# Altium schematic sheet UCC27511_MSFTDRIVER.SchDoc
size B; Organization: Altium Limited; Address1: L3, 12a Rodborough Rd; Address2: Frenchs Forest; Address3: NSW; Address4: Australia 2086; SheetNumber: 1; SheetTotal: 1
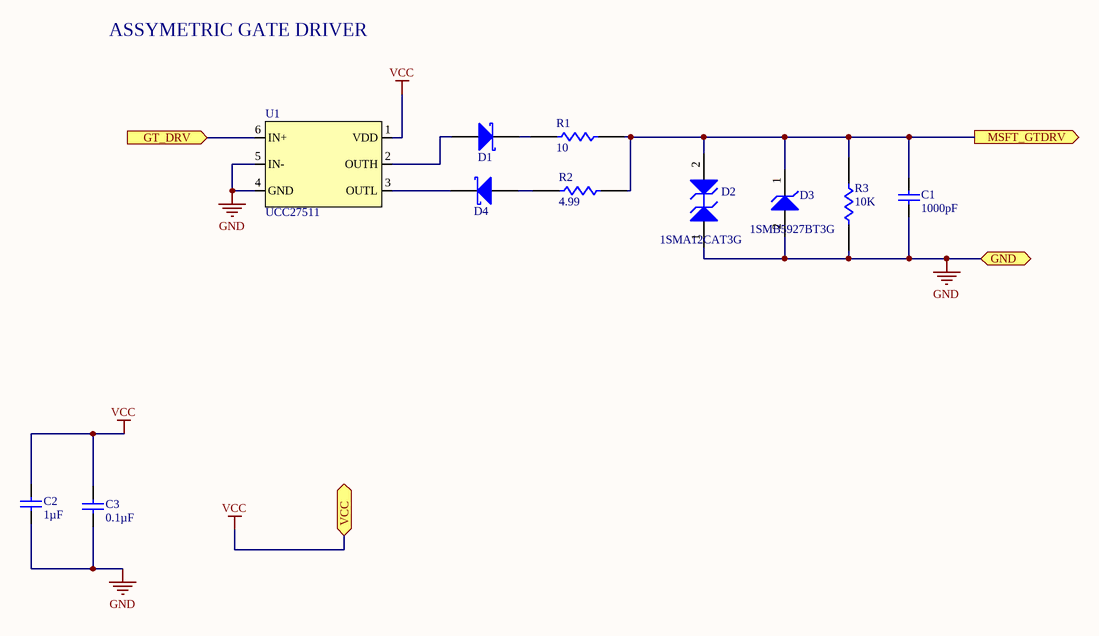
[diagram p0: UCC27511_MSFTDRIVER.SchDoc]

## Parts
C1  Capacitance: 1000pF  [CAP0805_NEW]  (hidden comment: C0805C102J5GACTU)
C2  Capacitance: 1µF  [CAP0805_NEW]  (hidden comment: CC0805JKX7R9BB105)
C3  Capacitance: 0.1µF  [CAP0805_NEW]  (hidden comment: C0805C104J5RACAUTO)
D1  DB2W40300L  [Mini2-F3-B]  (value not drawn)
D2  1SMA12CAT3G  [ONSC-SMA-2-403D-02_F_V]
D3  1SMB5927BT3G  [ONSC-SMB-2-403A-03_H_V]
D4  DB2W40300L  [Mini2-F3-B]  (value not drawn)
R1  Resistance: 10  [RES0805]  (hidden comment: CRCW0805R10)
R2  Resistance: 4.99  [RES0805]  (hidden comment: CRCW0805R4.99)
R3  Resistance: 10K  [RES0805_New]  (hidden comment: TNPW080510K0FEEA)
U1  IC name: UCC27511  [SOP6]  (hidden comment: UCC27511DBV)

## Ports
GND, GT_DRV (in), MSFT_GTDRV (out), VCC

## Nets
GND: C1.1 C2.1 C3.1 D2.1(A1) D3.2(A) R3.2 U1.4(GND) U1.5(IN-) ; port GND
VCC: C2.2 C3.2 U1.1(VDD) ; port VCC
GT_DRV: U1.6(IN+) ; port GT_DRV
MSFT_GTDRV: C1.2 D2.2(A2) D3.1(K) R1.1 R2.1 R3.1 ; port MSFT_GTDRV
NetD1_1: D1.1(K) R1.2
NetD1_3: D1.3(A) U1.2(OUTH)
NetD4_1: D4.1(K) U1.3(OUTL)
NetD4_3: D4.3(A) R2.2

## Notes on the sheet
- ASSYMETRIC GATE DRIVER
- Title:
- Size:
- B
- Document Number:
- Revision:
- Designer:
- Approval Date:
- Start Date:
- MM/DD/YY
- --/--/--
- Sheet:
- of
- Approver:
- CONFIDENTIAL
- Project Name/Number:

## Library data of the parts
C1 = C0805C102J5GACTU: CAP CER 1000PF 50V C0G/NP0 0805; Manufacturer: KEMET; Tolerance: ±5%; Temperature Coefficient: C0G, NP0; Supplier 1: Digi-Key; Manufacturer Part Number: C0805C102J5GACTU; RoHS: RoHS Compliant; Category: Capacitors; Stock 1: 297579; Pricing 1: 1=0.12, 10=0.09, 100=0.0403, 500=0.02876, 1000=0.0226 (USD); Packaging: Cut Tape (CT); Part Status: Active; Voltage - Rated: 50V; Operating Temperature: -55°C ~ 125°C; Features: Low ESL; Ratings: -; Applications: General Purpose; Failure Rate: -; Mounting Type: Surface Mount, MLCC; Package / Case: 0805 (2012 Metric); Size / Dimension: 0.079" L x 0.049" W (2.00mm x 1.25mm); Height - Seated (Max): -; Thickness (Max): 0.035" (0.88mm); Lead Spacing: -; Lead Style: -; ComponentLink1URL: http://www.kemet.com/docfinder?Partnumber=C0805C102J5GACTU; ComponentLink1Description: http://www.kemet.com/docfinder?Partnumber=C0805C102J5GACTU; Supplier Part Number 1: 399-1136-1-ND
C2 = CC0805JKX7R9BB105: CAP CER 1UF 50V X7R 0805; Manufacturer: Yageo; Tolerance: ±5%; Supplier 1: Digi-Key; Manufacturer Part Number: CC0805JKX7R9BB105; RoHS: RoHS Compliant; Category: Capacitors; Stock 1: 1863; Pricing 1: 1=0.34, 10=0.231, 100=0.131, 500=0.09248, 1000=0.08093 (USD); Packaging: Cut Tape (CT); Part Status: Active; Voltage - Rated: 50V; Temperature Coefficient: X7R; Operating Temperature: -55°C ~ 125°C; Features: -; Ratings: -; Applications: General Purpose; Failure Rate: -; Mounting Type: Surface Mount, MLCC; Package / Case: 0805 (2012 Metric); Size / Dimension: 0.079" L x 0.049" W (2.00mm x 1.25mm); Height - Seated (Max): -; Thickness (Max): 0.057" (1.45mm); Lead Spacing: -; Lead Style: -; ComponentLink1URL: http://www.yageo.com/documents/recent/UPY-GPHC_X7R_6.3V-to-50V_18.pdf; ComponentLink1Description: http://www.yageo.com/documents/recent/UPY-GPHC_X7R_6.3V-to-50V_18.pdf; Supplier Part Number 1: 311-3498-1-ND
C3 = C0805C104J5RACAUTO: CAP CER 0.1UF 50V X7R 0805; Manufacturer: KEMET; Tolerance: ±5%; Supplier 1: Digi-Key; Manufacturer Part Number: C0805C104J5RACAUTO; RoHS: RoHS Compliant; Category: Capacitors; Stock 1: 8605; Pricing 1: 1=0.22, 10=0.152, 100=0.0769, 500=0.05262, 1000=0.04655 (USD); Packaging: Cut Tape (CT); Part Status: Active; Voltage - Rated: 50V; Temperature Coefficient: X7R; Operating Temperature: -55°C ~ 125°C; Features: -; Ratings: AEC-Q200; Applications: Automotive; Failure Rate: -; Mounting Type: Surface Mount, MLCC; Package / Case: 0805 (2012 Metric); Size / Dimension: 0.079" L x 0.049" W (2.00mm x 1.25mm); Height - Seated (Max): -; Thickness (Max): 0.035" (0.88mm); Lead Spacing: -; Lead Style: -; ComponentLink1URL: http://www.kemet.com/docfinder?Partnumber=C0805C104J5RACAUTO; ComponentLink1Description: http://www.kemet.com/docfinder?Partnumber=C0805C104J5RACAUTO; Supplier Part Number 1: 399-6925-1-ND
D1 D4 = DB2W40300L: Manufacturer: Panasonic; Diode: DB24403
D2 = 1SMA12CAT3G: 400 W Peak Power Zener Transient Voltage Suppressor, 2-Pin SMA, Pb-Free, Tape and Reel; Manufacturer: On Semiconductor; Direction: Bidirectional; IR Max (uA): 2.5; PPK Max (W): 400; V(BR) Typ (V): 14; DatasheetVersion: Rev. 12; PackageVersion: Rev. F, 11/2008; PackageReference: SMA-2-403D-02_F; PackageDescription: 2-Pin Small Molded Package, J-Bend Lead, Body 2.605 x 4.315 mm; Supplier 1: Digi-Key; Supplier Part Number 1: 1SMA12CAT3GOSTR-ND; Supplier 2: Digi-Key; Supplier Part Number 2: 1SMA12CAT3GOSCT-ND; Supplier 3: Digi-Key; Supplier Part Number 3: 1SMA12CAT3GOSDKR-ND; Supplier 4: Farnell; Supplier Part Number 4: 2369441; Supplier 5: Newark; Supplier Part Number 5: 10N9650; Supplier 6: Mouser; Supplier Part Number 6: 863-1SMA12CAT3G; Packing: Tape and Reel; RoHS: Pb-Free; Mounting Technology: Surface Mount; PartNumber: 1SMA12CAT3G; ComponentLink1Description: Manufacturer URL; ComponentLink1URL: http://www.onsemi.com/; ComponentLink2Description: Datasheet; ComponentLink2URL: http://www.onsemi.com/pub_link/Collateral/1SMA10CAT3-D.PDF; ComponentLink3Description: Package Specification; ComponentLink3URL: http://www.onsemi.com/pub_link/Collateral/1SMA5913BT3-D.PDF
D3 = 1SMB5927BT3G: 3 W Zener Voltage Regulator, 2-Pin SMB, Pb-Free, Tape and Reel; Manufacturer: On Semiconductor; VZ Typ (V): 12; DatasheetVersion: Rev. 8; PackageVersion: Rev. H, 05/2011; PackageReference: SMB-2-403A-03_H; PackageDescription: 2-Pin Small Molded Package, J-Bend Lead, Body 4.33 x 3.625 mm; Supplier 1: Digi-Key; Supplier Part Number 1: 1SMB5927BT3GOSTR-ND; Supplier 2: Digi-Key; Supplier Part Number 2: 1SMB5927BT3GOSCT-ND; Supplier 3: Farnell; Supplier Part Number 3: 1431169RL; Supplier 4: Farnell; Supplier Part Number 4: 1431169; Supplier 5: Farnell; Supplier Part Number 5: 2368211; Supplier 6: Newark; Supplier Part Number 6: 45J2452; Supplier 7: Newark; Supplier Part Number 7: 67R1409; Supplier 8: Mouser; Supplier Part Number 8: 863-1SMB5927BT3G; Packing: Tape and Reel; RoHS: Pb-Free; Mounting Technology: Surface Mount; PartNumber: 1SMB5927BT3G; ComponentLink1Description: Manufacturer URL; ComponentLink1URL: http://www.onsemi.com/; ComponentLink2Description: Datasheet; ComponentLink2URL: http://www.onsemi.com/pub_link/Collateral/1SMB5913BT3-D.PDF; ComponentLink3Description: Package Specification; ComponentLink3URL: http://www.onsemi.com/pub_link/Collateral/1SMB5913BT3-D.PDF
R3 = TNPW080510K0FEEA: RES 10K OHM 1% 1/5W 0805; Manufacturer: Vishay Dale; Power (Watts): 0.2W, 1/5W; Temperature Coefficient: ±25ppm/°C; Supplier 1: Digi-Key; Manufacturer Part Number: TNPW080510K0FEEA; RoHS: RoHS Compliant; Category: Resistors; Stock 1: 5000; Pricing 1: 1=0.42, 10=0.319, 100=0.134, 1000=0.07392, 2500=0.0693 (USD); Packaging: Cut Tape (CT); Part Status: Active; Tolerance: ±1%; Composition: Thin Film; Features: Anti-Sulfur, Automotive AEC-Q200, Moisture Resistant; Operating Temperature: -55°C ~ 155°C; Package / Case: 0805 (2012 Metric); Supplier Device Package: 0805; Size / Dimension: 0.079" L x 0.049" W (2.00mm x 1.25mm); Height - Seated (Max): 0.022" (0.55mm); Failure Rate: -; ComponentLink1URL: http://www.vishay.com/docs/28758/tnpw_e3.pdf; ComponentLink1Description: http://www.vishay.com/docs/28758/tnpw_e3.pdf; Supplier Part Number 1: 541-3915-1-ND